# Altium schematic sheet Stepper Motor Driver.SchDoc
size A4; DrawnBy: KB
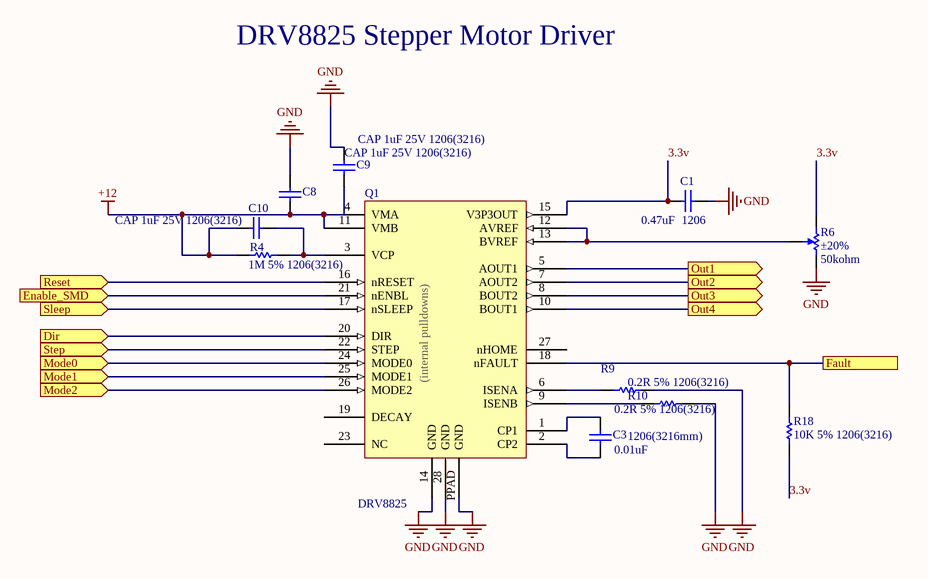
[diagram p0: Stepper Motor Driver.SchDoc]

## Parts
C1  Capacitance: 0.47uF  Package Reference: 1206  [CAPC3216X100X50NL20T25]  (hidden comment: 1206C474K5RACTU)
C3  Case Size: 1206(3216mm)  Capacitance: 0.01uF  [KEMT-1206-2_L]  (hidden comment: C1206C103K5RACTU)
C8  CAP 1uF 25V 1206(3216)  [CAPC1206(3216)170_M]
C9  CAP 1uF 25V 1206(3216)  [CAPC1206(3216)170_M]
C10  CAP 1uF 25V 1206(3216)  [CAPC1206(3216)170_M]
Q1  DRV8825  [DRV8825 HTSSOP]
R4  1M 5% 1206(3216)  [RESC1206(3216)_L]
R6  Resistance Tolerance: ±20%  Track Resistance: 50kohm  [BOUR-3313J-1_V]  (hidden comment: 3313J-1-503E)
R9  0.2R 5% 1206(3216)  [RESC1206(3216)_L]
R10  0.2R 5% 1206(3216)  [RESC1206(3216)_L]
R18  10K 5% 1206(3216)  [RESC1206(3216)_M]

## Ports
Dir (in), Enable_SMD (in), Fault, Mode0 (in), Mode1 (in), Mode2 (in), Out1 (out), Out2 (out), Out3 (out), Out4 (out), Reset (in), Sleep (in), Step (in)

## Nets
+12: C8.1 C9.1 C10.2 Q1.4(VMA) Q1.11(VMB) R4.1
GND: C1.2 C8.2 C9.2 Q1.14(GND) Q1.28(GND) Q1.PPAD(GND) R6.3 R9.2 R10.2
3.3v: C1.1 Q1.15(V3P3OUT) R6.1 R18.1
Dir: Q1.20(DIR) ; port Dir
Enable_SMD: Q1.21(nENBL) ; port Enable_SMD
Fault: Q1.18(nFAULT) R18.2 ; port Fault
Mode0: Q1.24(MODE0) ; port Mode0
Mode1: Q1.25(MODE1) ; port Mode1
Mode2: Q1.26(MODE2) ; port Mode2
Out1: Q1.5(AOUT1) ; port Out1
Out2: Q1.7(AOUT2) ; port Out2
Out3: Q1.8(BOUT2) ; port Out3
Out4: Q1.10(BOUT1) ; port Out4
Reset: Q1.16(nRESET) ; port Reset
Sleep: Q1.17(nSLEEP) ; port Sleep
Step: Q1.22(STEP) ; port Step
NetC3_1: C3.1 Q1.2(CP2)
NetC3_2: C3.2 Q1.1(CP1)
NetC10_1: C10.1 Q1.3(VCP) R4.2
NetQ1_6: Q1.6(ISENA) R9.1
NetQ1_9: Q1.9(ISENB) R10.1
NetQ1_12: Q1.12(AVREF) Q1.13(BVREF) R6.2

Not connected (* = marked no-connect by the designer): Q1 19(DECAY) 23(NC) 27(nHOME)

## Notes on the sheet
- DRV8825 Stepper Motor Driver
- CC2511 Assignment2 Group 3
- Date:
- Sheet
- of
- Time:
- Revision:
- Kim Bender, Peng Cheng
- Levi Smith, Fuzhen Liu
- Drawn by:
- File:
- (in symbol Stepper motor driver DRV8825) (internal pulldowns)

## Library data of the parts
C1 = CMP-2000-06016-1: Chip Capacitor, 470 nF, +/- 10%, 50 V, -55 to 125 degC, 1206 (3216 Metric), RoHS, Tape and Reel; Manufacturer: Kemet; Case Length: 3.2mm; Class: 2; Case Height: 0.9mm; Capacitance - pF: 470000pF; Capacitance - nF: 470nF; Dielectric: X7R; Voltage Rating DC: 50V; Case Width: 1.6mm; Temperature Coefficient / Code: +/-15%; Type: SMDMLCCsX7R,Commercial; Manufacturer URL: http://www.kemet.com/; Maximum Operating Temperature: +125C; Minimum Operating Temperature: -55C; Brand: Kemet; Case Code - in: 1206; Datasheet Version: 02/2016; Case Code - mm: 3216; Series: C1206C; Mounting Technology: SurfaceMount; Termination Style: SMD/SMT; Tolerance: 10%; Datasheet URL: http://www.kemet.com/docfinder?Partnumber=C1206C106K8RACTU; Dimensions: 1.6mmWx3.2mmLx0.9mmH; Packaging: Reel; Factory Pack Quantity: 4000; Product Category: MultilayerCeramicCapacitorsMLCC-SMD/SMT; RoHS: Details; Operating Temperature Range: -55Cto+125C; Product: GeneralTypeMLCCs; Package Description: 2-Pin Surface Mount Device, Body 3.2 x 1.6 mm; Package / Case: 1206(3216metric); Voltage Rating: 50V
C3 = CMP-2000-06008-1: Surface Mount Multilayer Ceramic Chip Capacitor, X7R Dielectric, 50 V, -55 to 125 degC, 2-Pin SMD (1206), RoHS, Tape and Reel; Manufacturer: Kemet; Voltage Rating: 50V; Brand/Series: CSeries; Tolerance: 10%; Mounting Technology: SurfaceMount; Material, Element: Ceramic; Termination: SMD; Temperature Coefficient: X7R; Package Reference: 1206-2; Dimensions: 0.126"x0.063"(3.2x1.6mm)LxW; Package Description: 2-Leads SMD, Body 3.2 x 1.6 mm; Datasheet Version: 07/2013; Manufacturer URL: http://www.kemet.com/; Mounting Type: PCB; Datasheet URL: https://datasheet.ciiva.com/7729/1725435-7729792.pdf
C8-C10 = CMP-1037-04701-1: CAP 1uF 25V ±10% 1206 (3216 Metric) Thickness 1.7mm SMD; Case-Metric: 3216; Tolerance: Â±10%; Case-EIA: 1206; Rated Voltage: 25 V; Value: 1uF; Max Thickness: 1.7 mm; Technology: SMT
Q1 = Stepper motor driver DRV8825: TI DRV8825 Stepper Motor Controller IC
R4 = CMP-1014-00146-1: 1M 0.25W 5% 1206 (3216 Metric)  SMD; Value: 1000000.00 Ohm; Case-EIA: 1206; Case-Metric: 3216; Power: 0.25 W; Technology: SMT; Tolerance: 5 %
R6 = CMP-2000-05588-1: 3 mm Trimpot(R) Trimming Potentiometer, 50 KOhm, +/- 20%, 0.125 W, -55 to 125 degC, 3-Pin SMD, RoHS, Tape and Reel; Manufacturer: Bourns; SVHC: NoSVHC(19-Dec-2012); Temperature Coefficient: ±150ppm/°C; No. of Turns: 1; Power Rating: 125mW; Manufacturer URL: http://www.bourns.com/; Potentiometer Mounting: SMD; Package Description: 3-Pin Surface Mount Device, Body 3.5 x 3.2 mm, Pitch 1.15 mm; Package Reference: 3313J-1; Mounting Technology: SurfaceMount; Datasheet Version: 05/2016; Datasheet URL: http://www.bourns.com/docs/Product-Datasheets/3313.pdf; Parameter 1: *
R9 R10 = CMP-1014-00057-1: 0.2R 0.25W 5% 1206 (3216 Metric)  SMD; Case-EIA: 1206; Value: 200.00 Ohm; Case-Metric: 3216; Tolerance: 5 %; Technology: SMT; Power: 0.25 W
R18 = CMP-1014-00098-1: 10K 0.25W 5% 1206 (3216 Metric)  SMD; Value: 10000.00 Ohm; Case-Metric: 3216; Case-EIA: 1206; Power: 0.25 W; Tolerance: 5 %; Technology: SMT